# Altium schematic sheet Oxygen_Sensor.SchDoc
size A; SheetNumber: 7; SheetTotal: 12
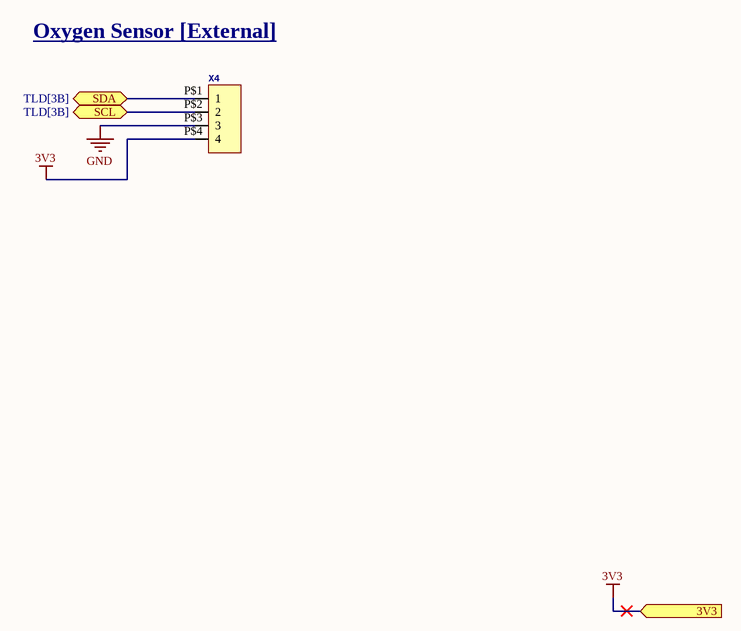
[diagram p0: Oxygen_Sensor.SchDoc]

## Parts
X4  Molex - Micro-Fit 3.0 Series connector,  3.00mm (0.118") pitch header, 4 positions.  [43045-0400]  (value not drawn)

## Ports
3V3 (in), SCL (bidir, see TLD[3B]), SDA (bidir, see TLD[3B])

## Nets
3V3: X4.P$4(4) ; port 3V3
GND: X4.P$3(3)
SCL: X4.P$2(2) ; port SCL
SDA: X4.P$1(1) ; port SDA

## Notes on the sheet
- Oxygen Sensor [External]

## Library data of the parts
X4 = HEADER_POS4_?43045-0401: GateName_1: G$1; SymbolName_1: HEADER_POS4; DeviceName: 43045-0401; LibraryName: con-molex-micro-fit-3_0_2; DeviceSetName: HEADER_POS4_?; Package: 43045-0400